# EAGLE design VISCAShield (EAGLE 9.4.2)
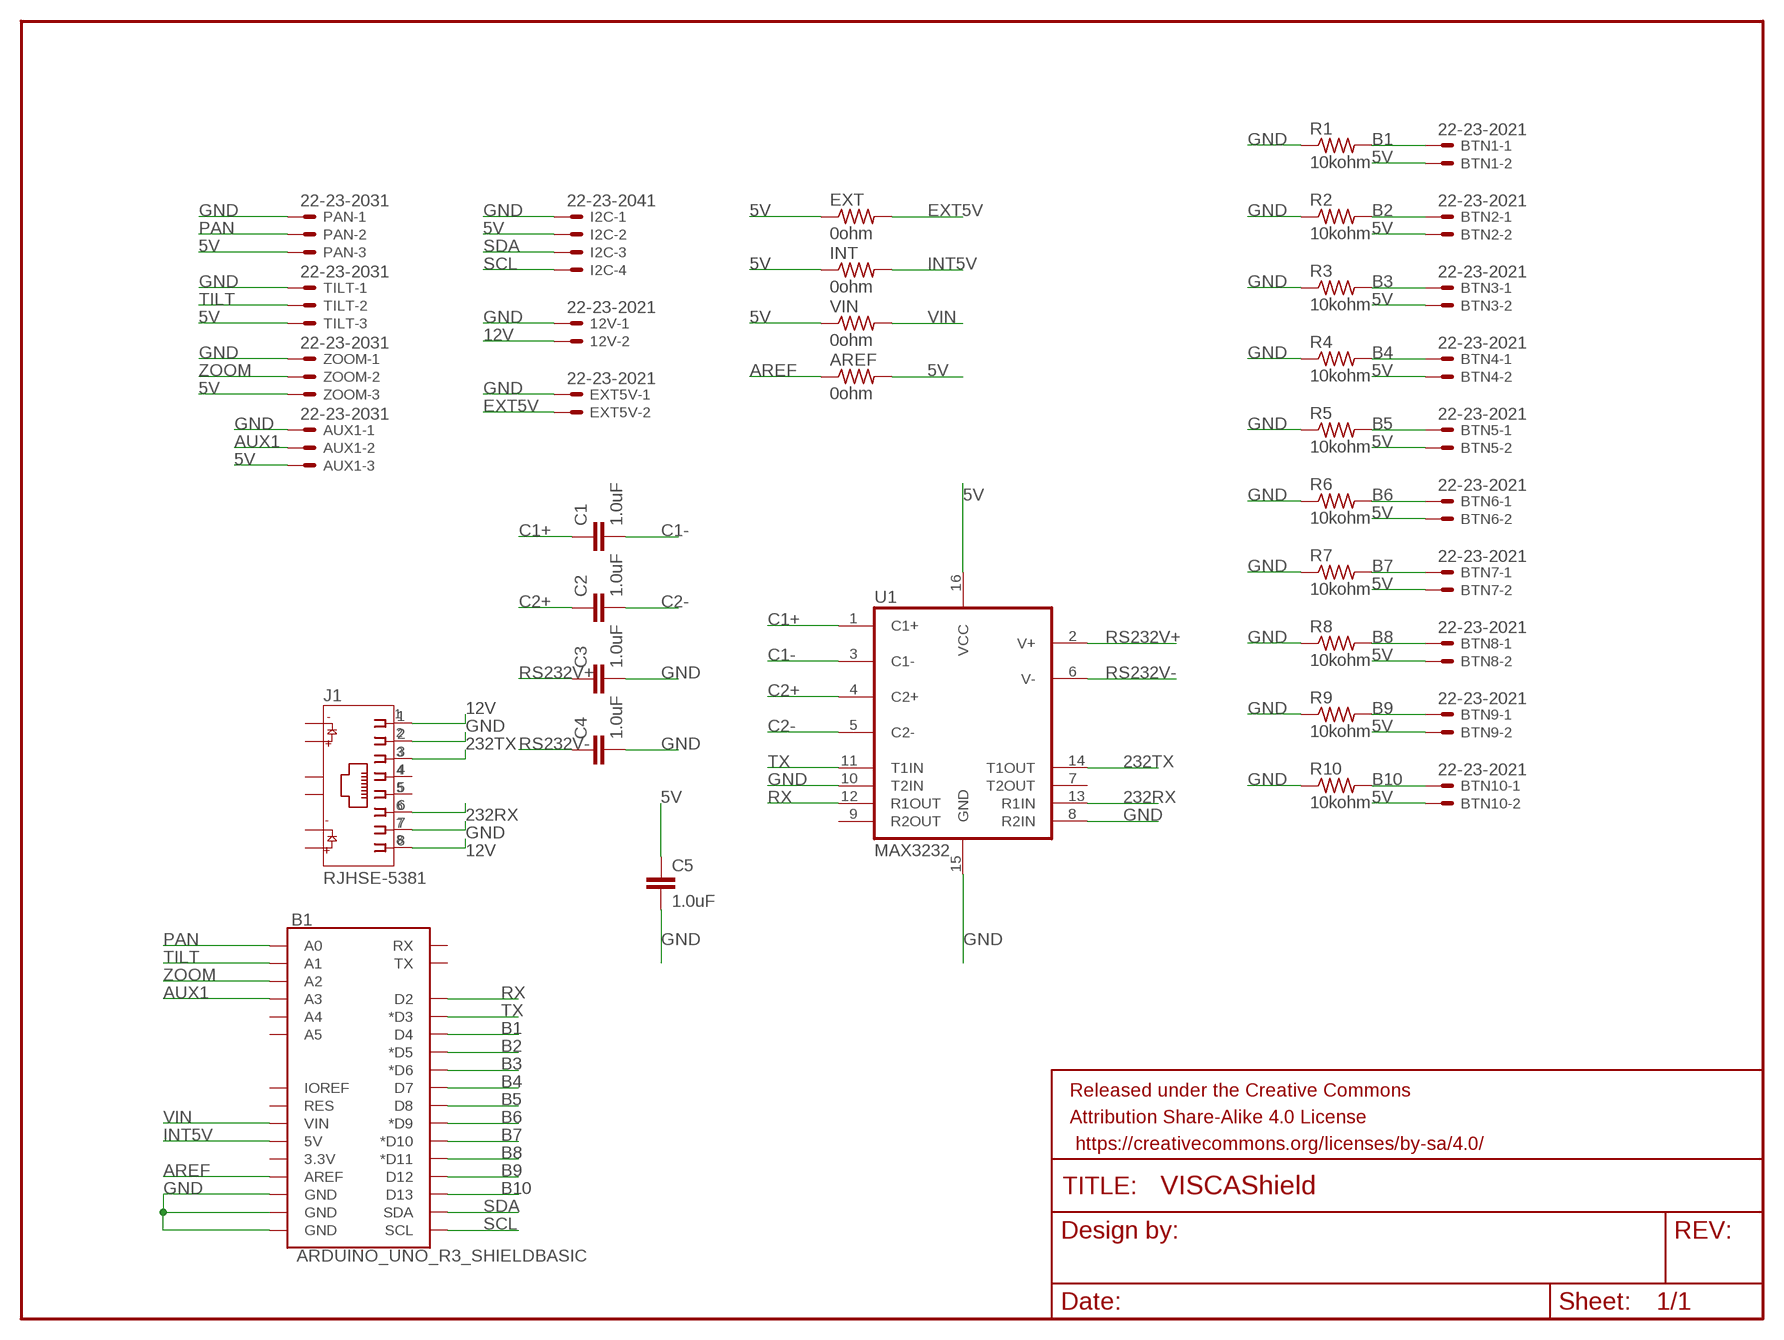
[diagram p0: schematic, sheet 1]

## Parts
12V  22-23-2021  [22-23-2021]
AREF  0ohm  R-US_0204/2V  [0204V]
AUX1  22-23-2031  [22-23-2031]
B1  ARDUINO_UNO_R3_SHIELDBASIC  [UNO_R3_SHIELD]
BTN1  22-23-2021  [22-23-2021]
BTN2  22-23-2021  [22-23-2021]
BTN3  22-23-2021  [22-23-2021]
BTN4  22-23-2021  [22-23-2021]
BTN5  22-23-2021  [22-23-2021]
BTN6  22-23-2021  [22-23-2021]
BTN7  22-23-2021  [22-23-2021]
BTN8  22-23-2021  [22-23-2021]
BTN9  22-23-2021  [22-23-2021]
BTN10  22-23-2021  [22-23-2021]
C1  1.0uF  1.0UF-0805-25V-(+80/-20%)  [0805]
C2  1.0uF  1.0UF-0805-25V-(+80/-20%)  [0805]
C3  1.0uF  1.0UF-0805-25V-(+80/-20%)  [0805]
C4  1.0uF  1.0UF-0805-25V-(+80/-20%)  [0805]
C5  1.0uF  1.0UF-0805-25V-(+80/-20%)  [0805]
EXT  0ohm  R-US_0204/2V  [0204V]
EXT5V  22-23-2021  [22-23-2021]
FRAME1  FRAME-LETTERNO_PACKAGE  [DUMMY]
I2C  22-23-2041  [22-23-2041]
INT  0ohm  R-US_0204/2V  [0204V]
J1  RJHSE-5381  [AMPHENOL_RJHSE-5381]
PAN  22-23-2031  [22-23-2031]
R1  10kohm  R-US_0204/2V  [0204V]
R2  10kohm  R-US_0204/2V  [0204V]
R3  10kohm  R-US_0204/2V  [0204V]
R4  10kohm  R-US_0204/2V  [0204V]
R5  10kohm  R-US_0204/2V  [0204V]
R6  10kohm  R-US_0204/2V  [0204V]
R7  10kohm  R-US_0204/2V  [0204V]
R8  10kohm  R-US_0204/2V  [0204V]
R9  10kohm  R-US_0204/2V  [0204V]
R10  10kohm  R-US_0204/2V  [0204V]
TILT  22-23-2031  [22-23-2031]
U1  MAX3232  MAX2323SOIC16  [SO16]
VIN  0ohm  R-US_0204/2V  [0204V]
ZOOM  22-23-2031  [22-23-2031]

## Nets
5V: AREF.2 AUX1.3 BTN1.2 BTN2.2 BTN3.2 BTN4.2 BTN5.2 BTN6.2 BTN7.2 BTN8.2 BTN9.2 BTN10.2 C5.1 EXT.1 I2C.2 INT.1 PAN.3 TILT.3 U1.16(VCC) VIN.1 ZOOM.3
12V: 12V.2 J1.1 J1.8
232RX: J1.6 U1.13(R1IN)
232TX: J1.3 U1.14(T1OUT)
AREF: AREF.1 B1.AREF
AUX1: AUX1.2 B1.A3
B1: B1.D4 BTN1.1 R1.2
B2: B1.D5(*D5) BTN2.1 R2.2
B3: B1.D6(*D6) BTN3.1 R3.2
B4: B1.D7 BTN4.1 R4.2
B5: B1.D8 BTN5.1 R5.2
B6: B1.D9(*D9) BTN6.1 R6.2
B7: B1.D10(*D10) BTN7.1 R7.2
B8: B1.D11(*D11) BTN8.1 R8.2
B9: B1.D12 BTN9.1 R9.2
B10: B1.D13 BTN10.1 R10.2
C1+: C1.1 U1.1(C1+)
C1-: C1.2 U1.3(C1-)
C2+: C2.1 U1.4(C2+)
C2-: C2.2 U1.5(C2-)
EXT5V: EXT5V.2 EXT.2
GND: 12V.1 AUX1.1 B1.GND@0(GND) B1.GND@1(GND) B1.GND@2(GND) C3.2 C4.2 C5.2 EXT5V.1 I2C.1 J1.2 J1.7 PAN.1 R1.1 R2.1 R3.1 R4.1 R5.1 R6.1 R7.1 R8.1 R9.1 R10.1 TILT.1 U1.8(R2IN) U1.10(T2IN) U1.15(GND) ZOOM.1
INT5V: B1.5V INT.2
PAN: B1.A0 PAN.2
RS232V+: C3.1 U1.2(V+)
RS232V-: C4.1 U1.6(V-)
RX: B1.D2 U1.12(R1OUT)
SCL: B1.SCL I2C.4
SDA: B1.SDA I2C.3
TILT: B1.A1 TILT.2
TX: B1.D3(*D3) U1.11(T1IN)
VIN: B1.VIN VIN.2
ZOOM: B1.A2 ZOOM.2
Unconnected: B1.3.3V B1.A4 B1.A5 B1.IOREF B1.RES B1.RX B1.TX J1.4 J1.5 J1.9 J1.10 J1.11 J1.12 J1.S1 J1.S2 U1.7(T2OUT) U1.9(R2OUT)

## Library data of the parts
12V BTN1-BTN10 EXT5V = con-molex:22-23-2021: .100" (2.54mm) Center Header - 2 Pin; MF: MOLEX; MPN: 22-23-2021; OC_FARNELL: 1462926; OC_NEWARK: 25C3832
AREF EXT INT R1-R10 VIN = BeagleBone_Black_Wireless:R-US_: RESISTOR, American symbol
AUX1 PAN TILT ZOOM = con-molex:22-23-2031: .100" (2.54mm) Center Header - 3 Pin; MF: MOLEX; MPN: 22-23-2031; OC_FARNELL: 1462950; OC_NEWARK: 30C0862
B1 = SparkFun-Boards:ARDUINO_UNO_R3_SHIELD: Arduino R3 Shield Footprint Shield form compatible with the Arduino Uno R3. SparkFun Products: MG2639 Cellular Shield <https://www.sparkfun.com/products/13120> MIDI Shield <https://www.sparkfun.com/products/12898> R3 Stackable Headers Kit <https://www.sparkfun.com/products/11417>
C1-C5 = SparkFun-Capacitors:1.0UF: 1µF ceramic capacitors A capacitor is a passive two-terminal electrical component used to store electrical energy temporarily in an electric field.; PROD_ID: CAP-11625
FRAME1 = SparkFun-Aesthetics:FRAME-LETTER: Schematic Frame - Letter Standard 8.5x11 US Letter frame; DESIGNER: Nobody; VERSION: v01
I2C = con-molex:22-23-2041: .100" (2.54mm) Center Header - 4 Pin; MF: MOLEX; MPN: 22-23-2041; OC_FARNELL: 1462920; OC_NEWARK: 38C0355
J1 = RJHSE-5381:RJHSE-5381: connector, mod jack, rt angle pcb, shielded, led1-g, led2-y, single port, rj-45 8 cont; AVAILABILITY: Unavailable; DESCRIPTION: connector, mod jack, rt angle pcb, shielded, led1-g, led2-y, single port, rj-45 8 cont; MF: Amphenol ICC; MP: RJHSE-5381; PACKAGE: None; PRICE: None
U1 = SparkFun-IC-Comms:MAX2323: RS232 Transceiver This part covers 232 drivers that are compatible with the MAX3232. Sipex SP3232EB Datasheet <http://cdn.sparkfun.com/datasheets/Components/General%20IC/SP3232EBCA-L.pdf> SparkFun Products SOIC component <https://www.sparkfun.com/products/589> (COM-00589 / IC-08171) Retired DIP component (COM-00316 / IC-08446) SparkFun Transceiver Breakout - MAX3232 <https://www.sparkfun.com/products/11189> (BOB-11189) SparkFun XBee Explorer Serial <https://www.sparkfun.com/products/13225> (WRL-13225); PROD_ID: IC-08171

## Board
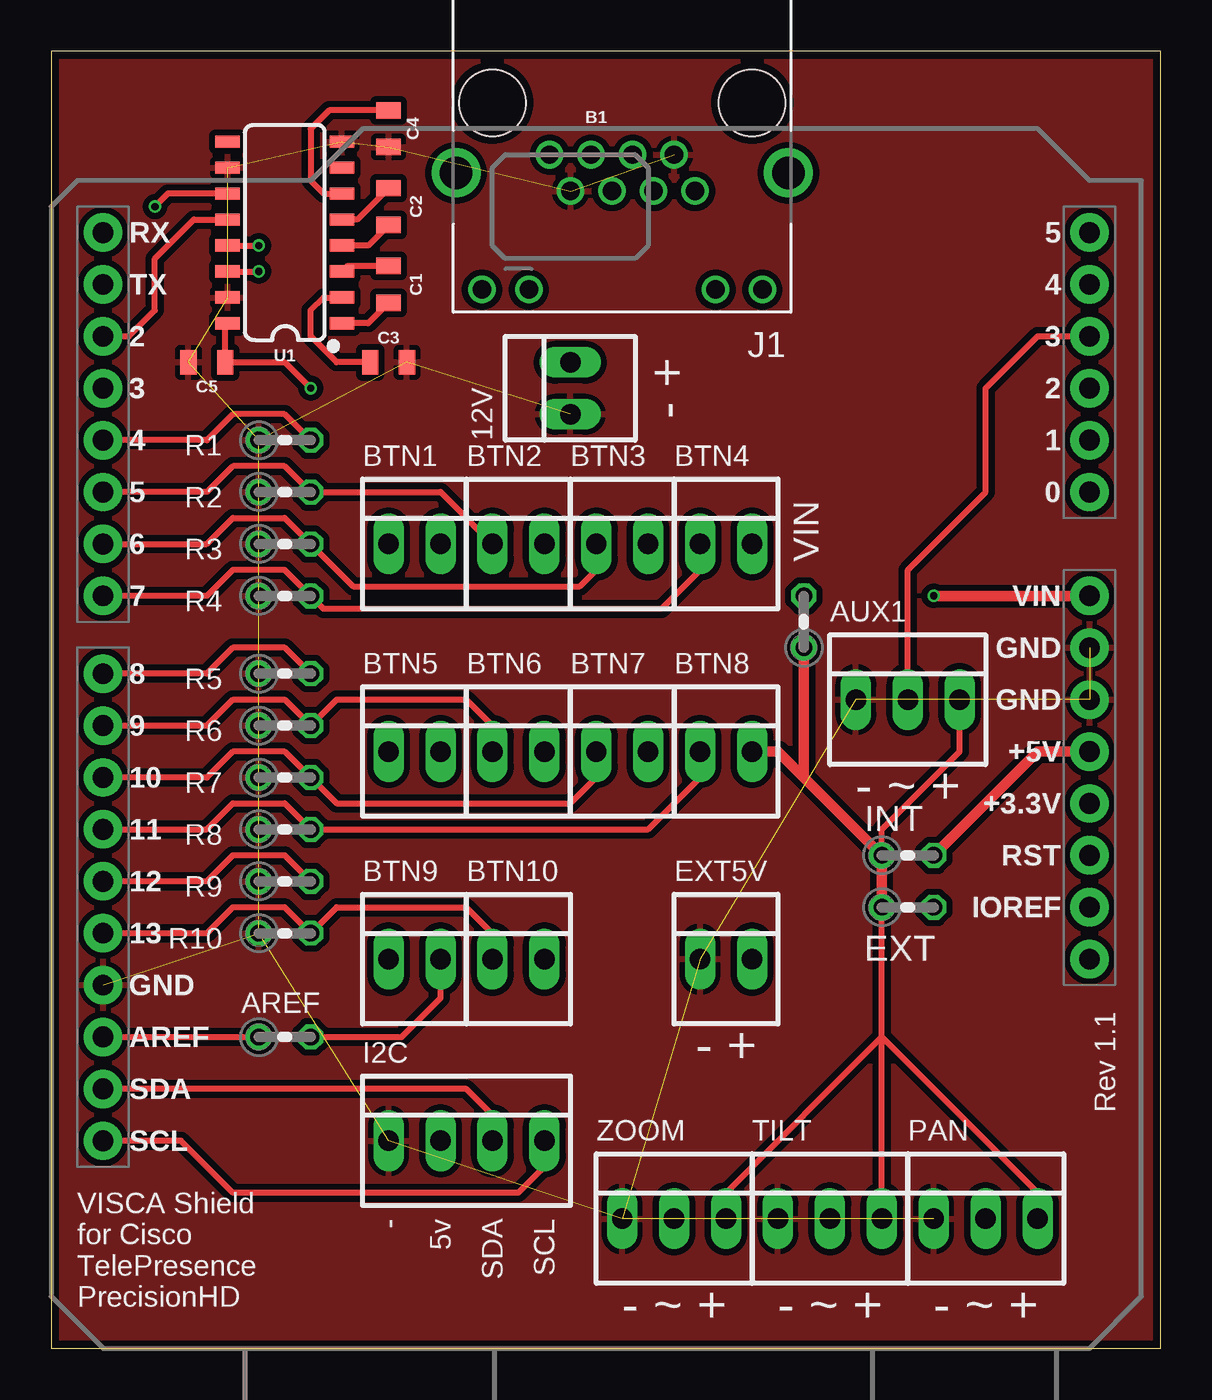
[diagram p1: board, top side]
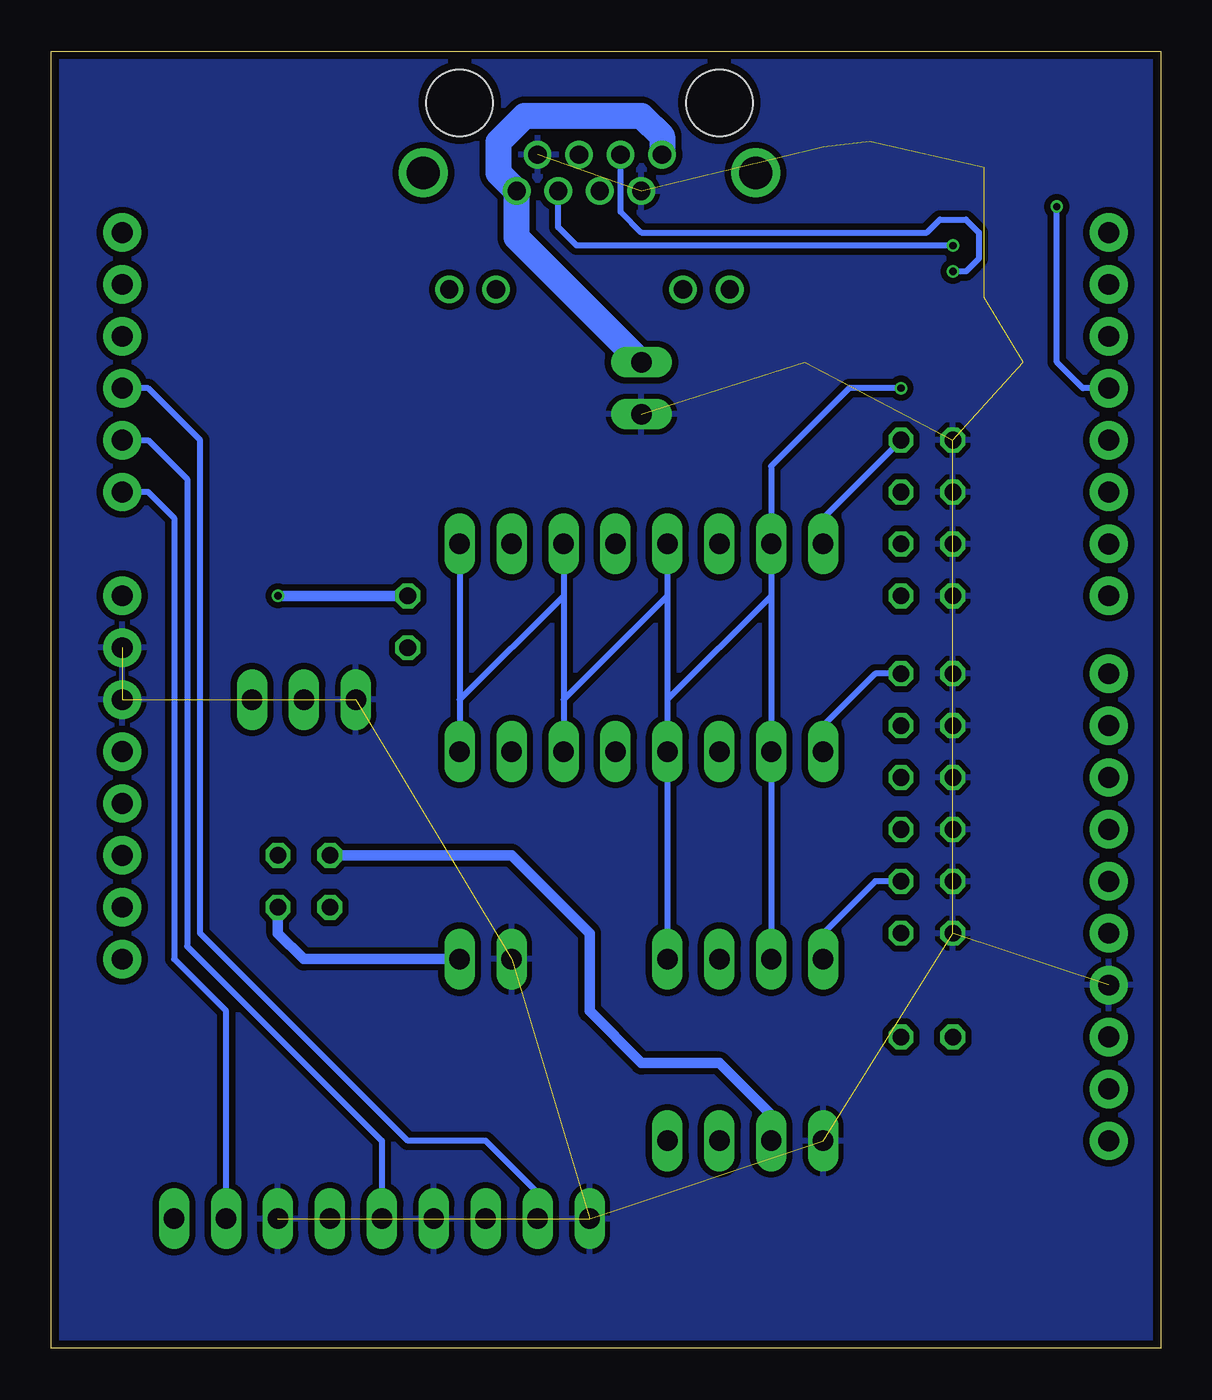
[diagram p2: board, bottom side, seen from below]

Size 54.28 x 63.49 mm. Coordinates in mm from the lower left corner, seen from the top.
Outline: 0,0 54.28,0 54.28,63.49 0,63.49 0,0
Copper layers (1*16): Top 0.035559375mm / dielectric 1.6mm / Bottom 0.035559375mm
Design rules "default": minimum track width 6mil, minimum drill 10mil, track to track 6mil, track to pad 6mil, pad to pad 6mil, via to via 6mil, smd to smd 6mil, copper to edge 15mil, drill to drill 6mil, minimum pad ring 5mil, minimum via ring 5mil, stop-mask expansion 2.5mil, vias tented up to drill 0mil, thermal gap 10mil

### Footprints (pad centres in the part's own frame; a part is rotated, then mirrored left to right if it is on the bottom)
22-23-2021 = drill 1 long: 1 -1.27,0; 2 1.27,0
0204V = drill 0.813 octagon: 1 -1.27,0; 2 1.27,0
22-23-2031 = drill 1 long: 1 -2.54,0; 2 0,0; 3 2.54,0
UNO_R3_SHIELD = drill 1.016 pad 1.88: 3.3V 24.13,-2.54; 5V 24.13,0; A0 24.13,12.7; A1 24.13,15.24; A2 24.13,17.78; A3 24.13,20.32; A4 24.13,22.86; A5 24.13,25.4; AREF -24.13,-13.97; D2 -24.13,20.32; D3 -24.13,17.78; D4 -24.13,15.24; D5 -24.13,12.7; D6 -24.13,10.16; D7 -24.13,7.62; D8 -24.13,3.81; D9 -24.13,1.27; D10 -24.13,-1.27; D11 -24.13,-3.81; D12 -24.13,-6.35; D13 -24.13,-8.89; GND@0 24.13,2.54; GND@1 24.13,5.08; GND@2 -24.13,-11.43; IOREF 24.13,-7.62; NC 24.13,-10.16; RES 24.13,-5.08; RX -24.13,25.4; SCL -24.13,-19.05; SDA -24.13,-16.51; TX -24.13,22.86; VIN 24.13,7.62
0805 = smd 0.8 x 1.2: 1 -0.9,0; 2 0.9,0
22-23-2041 = drill 1 long: 1 -3.81,0; 2 -1.27,0; 3 1.27,0; 4 3.81,0
AMPHENOL_RJHSE-5381 = drill 0.9: 1 3.55,2.54; 2 2.53,4.32; 3 1.52,2.54; 4 0.5,4.32; 5 -0.51,2.54; 6 -1.53,4.32; 7 -2.54,2.54; 8 -3.56,4.32; 9 6.86,9.14; 10 4.57,9.14; 11 -4.57,9.14; 12 -6.86,9.14 | drill 1.6: S1 8.13,3.43; S2 -8.13,3.43 | hole 3.25: 6.35,0; -6.35,0
SO16 = smd 0.6 x 1.2: 1 -4.445,-2.8; 2 -3.175,-2.8; 3 -1.905,-2.8; 4 -0.635,-2.8; 5 0.635,-2.8; 6 1.905,-2.8; 7 3.175,-2.8; 8 4.445,-2.8; 9 4.445,2.8; 10 3.175,2.8; 11 1.905,2.8; 12 0.635,2.8; 13 -0.635,2.8; 14 -1.905,2.8; 15 -3.175,2.8; 16 -4.445,2.8

### Placement (x,y rotation side)
12V  25.4,46.99 90 top
AREF  11.43,15.24 0 top
AUX1  41.91,31.75 0 top
B1  26.67,29.21 0 top
BTN1  17.78,39.37 0 top
BTN2  22.86,39.37 0 top
BTN3  27.94,39.37 0 top
BTN4  33.02,39.37 0 top
BTN5  17.78,29.21 0 top
BTN6  22.86,29.21 0 top
BTN7  27.94,29.21 0 top
BTN8  33.02,29.21 0 top
BTN9  17.78,19.05 0 top
BTN10  22.86,19.05 0 top
C1  16.51,52.07 90 top
C2  16.51,55.88 90 top
C3  16.51,48.26 0 top
C4  16.51,59.69 270 top
C5  7.62,48.26 180 top
EXT  41.91,21.59 0 top
EXT5V  33.02,19.05 0 top
FRAME1  -3.81,0 0 top  (outside the outline)
I2C  20.32,10.16 0 top
INT  41.91,24.13 0 top
J1  27.94,60.96 180 top
PAN  45.72,6.35 0 top
R1  11.43,44.45 0 top
R2  11.43,41.91 0 top
R3  11.43,39.37 0 top
R4  11.43,36.83 0 top
R5  11.43,33.02 0 top
R6  11.43,30.48 0 top
R7  11.43,27.94 0 top
R8  11.43,25.4 0 top
R9  11.43,22.86 0 top
R10  11.43,20.32 0 top
TILT  38.1,6.35 0 top
U1  11.43,54.61 90 top
VIN  36.83,35.56 90 top
ZOOM  30.48,6.35 0 top

### Tracks (layer width: path | path; a pad name or v marks a point on that pad's centre or on a via)
5V  (via drill 0.35)
  Top 0.305: INT.1 40.64,25.4 44.45,29.21 AUX1.3 | TILT.3 40.64,15.24 | 40.64,15.24 EXT.1 | PAN.3 48.26,7.62 40.64,15.24 | ZOOM.3 33.02,7.62 40.64,15.24 | U1.16 8.52,50.05 C5.1 11.43,48.26 v12.7,46.99 | AREF.2 17.14,15.24 19.05,17.14 BTN9.2
  Top 0.508: EXT.1 INT.1 36.83,27.94 | VIN.1 36.83,27.94 | BTN8.2 35.56,29.21 36.83,27.94
  Bottom 0.305: BTN1.2 BTN5.2 BTN9.2 | BTN6.2 BTN2.2 24.13,36.83 29.21,31.75 | BTN6.2 BTN10.2 | 29.21,31.75 BTN3.2 29.21,36.83 34.29,31.75 | BTN4.2 34.29,31.75 | BTN1.2 19.05,36.83 24.13,31.75 BTN6.2 | 29.21,31.75 BTN7.2 | 34.29,31.75 BTN8.2 | v12.7,46.99 15.24,46.99 19.05,43.18 BTN1.2
  Bottom 0.508: I2C.2 19.05,11.43 21.59,13.97 25.4,13.97 27.94,16.51 27.94,20.32 31.75,24.13 INT.1
12V
  Bottom 1.27: 12V.2 31.5,54.36 J1.8 32.38,57.52 32.38,59.05 31.11,60.33 25.4,60.33 24.39,59.31 J1.1
232RX  (via drill 0.35)
  Top 0.305: U1.13 v10.16,53.98
  Bottom 0.305: v10.16,53.98 28.57,53.98 29.47,54.87 J1.6
232TX  (via drill 0.35)
  Top 0.305: U1.14 v10.16,52.7
  Bottom 0.305: v10.16,52.7 9.53,52.7 8.89,53.34 8.89,54.61 9.53,55.24 10.79,55.24 11.43,54.61 25.4,54.61 26.42,55.63 J1.3
AREF
  Top 0.305: B1.AREF AREF.1
AUX1
  Top 0.305: AUX1.2 41.91,38.1 45.72,41.91 45.72,46.99 48.26,49.53 B1.A3
B1
  Top 0.305: R1.2 11.43,45.72 8.89,45.72 7.62,44.45 B1.D4
  Bottom 0.305: R1.2 16.51,40.64 BTN1.1
B2
  Top 0.305: B1.D5 7.62,41.91 8.89,43.18 11.43,43.18 R2.2 19.05,41.91 BTN2.1
B3
  Top 0.305: B1.D6 7.62,39.37 8.89,40.64 11.43,40.64 R3.2 14.78,37.29 25.86,37.29 26.67,38.1 BTN3.1
B4
  Top 0.305: B1.D7 7.62,36.83 8.89,38.1 11.43,38.1 R4.2 13.34,36.2 29.84,36.2 31.75,38.1 BTN4.1
B5
  Top 0.305: R5.2 11.43,34.29 8.89,34.29 7.62,33.02 B1.D8
  Bottom 0.305: R5.2 13.97,33.02 16.51,30.48 BTN5.1
B6
  Top 0.305: B1.D9 7.62,30.48 8.89,31.75 11.43,31.75 R6.2 13.97,31.75 20.32,31.75 21.59,30.48 BTN6.1
B7
  Top 0.305: B1.D10 7.62,27.94 8.89,29.21 11.43,29.21 R7.2 13.97,26.67 25.4,26.67 26.67,27.94 BTN7.1
B8
  Top 0.305: B1.D11 7.62,25.4 8.89,26.67 11.43,26.67 R8.2 29.21,25.4 31.75,27.94 BTN8.1
B9
  Top 0.305: R9.2 11.43,24.13 8.89,24.13 7.62,22.86 B1.D12
  Bottom 0.305: R9.2 13.97,22.86 16.51,20.32 BTN9.1
B10
  Top 0.305: B1.D13 7.62,20.32 8.89,21.59 11.43,21.59 R10.2 13.97,21.59 20.32,21.59 21.59,20.32 BTN10.1
C1+
  Top 0.305: C1.1 15.51,50.16 U1.1
C1-
  Top 0.305: C1.2 14.49,52.97 U1.3
C2+
  Top 0.305: C2.1 15.51,53.98 U1.4
C2-
  Top 0.305: C2.2 14.97,55.24 U1.5
EXT5V
  Bottom 0.508: EXT.2 43.18,20.32 41.91,19.05 EXT5V.2
GND  (27 unrouted)
  pour Bottom (isolate 0.305): 0,63.5 54.61,63.5 54.61,5.08 55.88,5.08 57.15,3.81 57.15,0 0,0
  pour Top (isolate 0.305): 0,63.5 54.61,63.5 54.61,0 0,0
INT5V
  Top 0.508: INT.2 48.26,29.21 B1.5V
PAN
  Bottom 0.305: PAN.2 45.72,16.51 48.26,19.05 48.26,40.64 49.53,41.91 B1.A0
RS232V+
  Top 0.305: C3.1 13.97,48.26 12.7,49.53 12.7,50.8 13.34,51.44 U1.2
RS232V-
  Top 0.305: U1.6 13.34,56.52 12.7,57.15 12.7,59.69 13.6,60.59 C4.1
RX
  Top 0.305: B1.D2 3.81,49.53 5.08,50.8 5.08,53.34 6.99,55.24 U1.12
SCL
  Top 0.305: I2C.4 24.13,8.89 22.86,7.62 8.89,7.62 6.35,10.16 B1.SCL
SDA
  Top 0.305: I2C.3 21.59,11.43 20.32,12.7 B1.SDA
TILT
  Bottom 0.305: B1.A1 49.53,44.45 47.62,42.55 47.62,19.68 38.1,10.16 TILT.2
TX  (via drill 0.35)
  Top 0.305: U1.11 5.71,56.52 v5.08,55.88
  Bottom 0.305: B1.D3 3.81,46.99 5.08,48.26 v5.08,55.88
VIN  (via drill 0.35)
  Top 0.508: v43.18,36.83 B1.VIN
  Bottom 0.508: VIN.2 v43.18,36.83
ZOOM
  Bottom 0.305: B1.A2 49.53,46.99 46.99,44.45 46.99,20.32 36.83,10.16 33.02,10.16 30.48,7.62 ZOOM.2

### Text on the board
tNames: - + | - ~ + | Rev 1.1 | - + | VISCA Shield / for Cisco / TelePresence / PrecisionHD | - | 5v | SDA | SCL | - ~ + | - ~ + | - ~ +